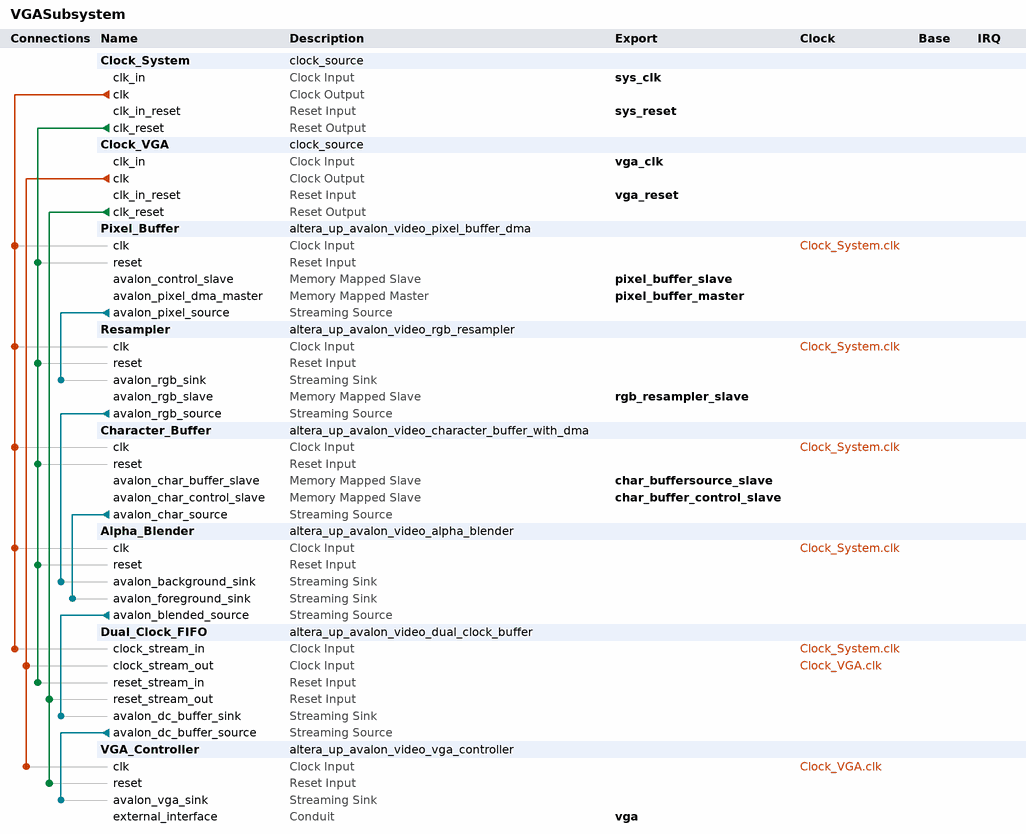
[diagram p0: system contents]
# Platform Designer (Qsys) system VGASubsystem, Cyclone IV E EP4CE22F17C6
# Parameters at their usual value, and those the tool derives, are not listed.
package require -exact qsys 18.0
create_system VGASubsystem
set_project_property DEVICE_FAMILY {Cyclone IV E}
set_project_property DEVICE EP4CE22F17C6

add_instance Clock_System clock_source 18.1
set_instance_parameter_value Clock_System clockFrequency 50000000
set_instance_parameter_value Clock_System clockFrequencyKnown false

add_instance Clock_VGA clock_source 18.1
set_instance_parameter_value Clock_VGA clockFrequency 25000000
set_instance_parameter_value Clock_VGA clockFrequencyKnown false

add_instance Pixel_Buffer altera_up_avalon_video_pixel_buffer_dma 18.0
set_instance_parameter_value Pixel_Buffer addr_mode Consecutive
set_instance_parameter_value Pixel_Buffer back_start_address 83886080
set_instance_parameter_value Pixel_Buffer color_space {16-bit RGB}
set_instance_parameter_value Pixel_Buffer image_height 480
set_instance_parameter_value Pixel_Buffer image_width 640
set_instance_parameter_value Pixel_Buffer start_address 83886080

add_instance Resampler altera_up_avalon_video_rgb_resampler 18.0
set_instance_parameter_value Resampler alpha 1023
set_instance_parameter_value Resampler input_type {16-bit RGB}
set_instance_parameter_value Resampler output_type {30-bit RGB}

add_instance Character_Buffer altera_up_avalon_video_character_buffer_with_dma 18.0
set_instance_parameter_value Character_Buffer enable_transparency true

add_instance Alpha_Blender altera_up_avalon_video_alpha_blender 18.0

add_instance Dual_Clock_FIFO altera_up_avalon_video_dual_clock_buffer 18.0
set_instance_parameter_value Dual_Clock_FIFO color_bits 10

add_instance VGA_Controller altera_up_avalon_video_vga_controller 18.1
set_instance_parameter_value VGA_Controller board DE10-Standard
set_instance_parameter_value VGA_Controller resolution {VGA 640x480}

# connections
add_connection Clock_System.clk Alpha_Blender.clk clock
add_connection Clock_System.clk Character_Buffer.clk clock
add_connection Clock_System.clk Dual_Clock_FIFO.clock_stream_in clock
add_connection Clock_System.clk Pixel_Buffer.clk clock
add_connection Clock_System.clk Resampler.clk clock
add_connection Clock_VGA.clk Dual_Clock_FIFO.clock_stream_out clock
add_connection Clock_VGA.clk VGA_Controller.clk clock
add_connection Clock_System.clk_reset Alpha_Blender.reset reset
add_connection Clock_System.clk_reset Character_Buffer.reset reset
add_connection Clock_System.clk_reset Dual_Clock_FIFO.reset_stream_in reset
add_connection Clock_System.clk_reset Pixel_Buffer.reset reset
add_connection Clock_System.clk_reset Resampler.reset reset
add_connection Clock_VGA.clk_reset Dual_Clock_FIFO.reset_stream_out reset
add_connection Clock_VGA.clk_reset VGA_Controller.reset reset
add_connection Alpha_Blender.avalon_blended_source Dual_Clock_FIFO.avalon_dc_buffer_sink avalon_streaming
add_connection Character_Buffer.avalon_char_source Alpha_Blender.avalon_foreground_sink avalon_streaming
add_connection Dual_Clock_FIFO.avalon_dc_buffer_source VGA_Controller.avalon_vga_sink avalon_streaming
add_connection Pixel_Buffer.avalon_pixel_source Resampler.avalon_rgb_sink avalon_streaming
add_connection Resampler.avalon_rgb_source Alpha_Blender.avalon_background_sink avalon_streaming

# exported interfaces
add_interface char_buffer_control_slave avalon slave
set_interface_property char_buffer_control_slave EXPORT_OF Character_Buffer.avalon_char_control_slave
add_interface char_buffersource_slave avalon slave
set_interface_property char_buffersource_slave EXPORT_OF Character_Buffer.avalon_char_buffer_slave
add_interface pixel_buffer_master avalon master
set_interface_property pixel_buffer_master EXPORT_OF Pixel_Buffer.avalon_pixel_dma_master
add_interface pixel_buffer_slave avalon slave
set_interface_property pixel_buffer_slave EXPORT_OF Pixel_Buffer.avalon_control_slave
add_interface rgb_resampler_slave avalon slave
set_interface_property rgb_resampler_slave EXPORT_OF Resampler.avalon_rgb_slave
add_interface sys_clk clock sink
set_interface_property sys_clk EXPORT_OF Clock_System.clk_in
add_interface sys_reset reset sink
set_interface_property sys_reset EXPORT_OF Clock_System.clk_in_reset
add_interface vga conduit end
set_interface_property vga EXPORT_OF VGA_Controller.external_interface
add_interface vga_clk clock sink
set_interface_property vga_clk EXPORT_OF Clock_VGA.clk_in
add_interface vga_reset reset sink
set_interface_property vga_reset EXPORT_OF Clock_VGA.clk_in_reset

set_interconnect_requirement {$system} qsys_mm.clockCrossingAdapter HANDSHAKE
set_interconnect_requirement {$system} qsys_mm.enableEccProtection FALSE
set_interconnect_requirement {$system} qsys_mm.insertDefaultSlave FALSE
set_interconnect_requirement {$system} qsys_mm.maxAdditionalLatency 1

save_system VGASubsystem.qsys
